# EasyEDA Pro project 一体板.epro, schematic Schematic1_1
Create Date: 2023-07-24; Page Name: P1; Project Name: 运放模块; Schematic Name: Schematic1; Update Date: 2023-07-25; Company: 嘉立创EDA; Page Size: A4; Version: V1.0
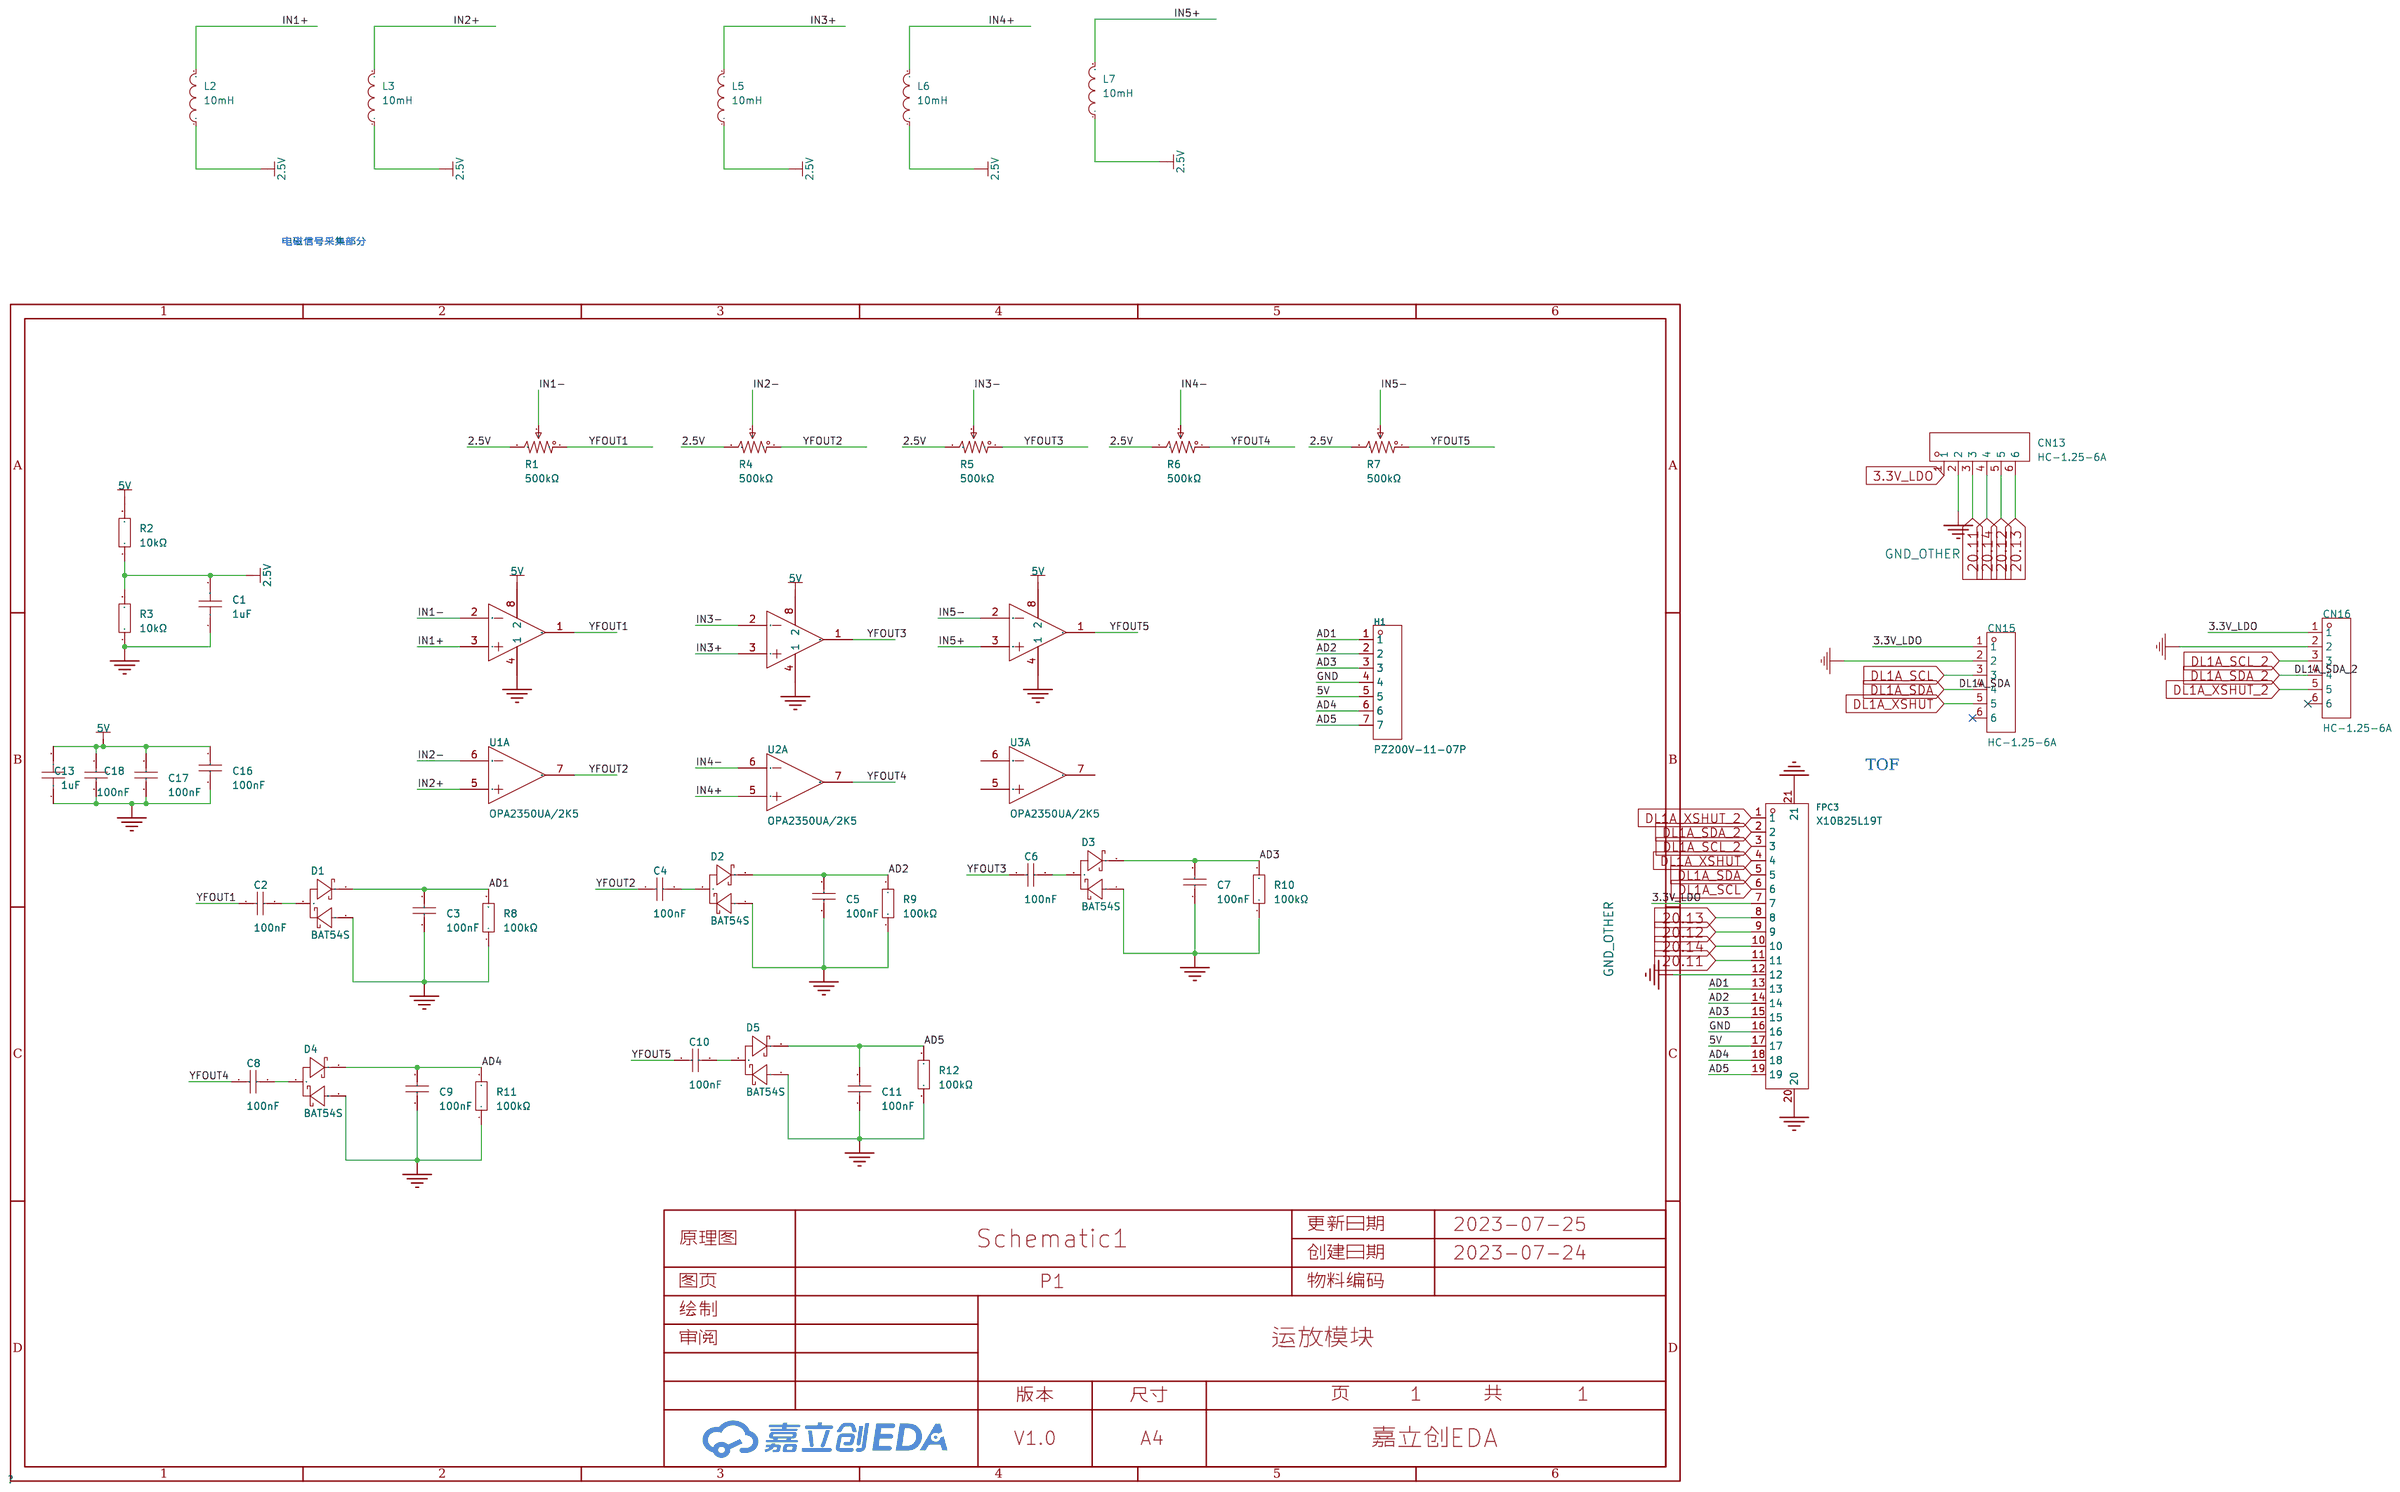
[diagram p1: schematic sheet]

## Parts
C1  1uF  [C0603]
C2  100nF  [C0603]
C3  100nF  [C0603]
C4  100nF  [C0603]
C5  100nF  [C0603]
C6  100nF  [C0603]
C7  100nF  [C0603]
C8  100nF  [C0603]
C9  100nF  [C0603]
C10  100nF  [C0603]
C11  100nF  [C0603]
C13  1uF  [C0603]
C16  100nF  [C0603]
C17  100nF  [C0603]
C18  100nF  [C0603]
CN13  HC-1.25-6A  [CONN-TH_6P-P1.25_HCTL_HC-1.25-6A]
CN15  HC-1.25-6A  [CONN-TH_6P-P1.25_HCTL_HC-1.25-6A]
CN16  HC-1.25-6A  [CONN-TH_6P-P1.25_HCTL_HC-1.25-6A]
D1  BAT54S  [SOT-23-3_L2.9-W1.3-P1.90-LS2.4-BR]
D2  BAT54S  [SOT-23-3_L2.9-W1.3-P1.90-LS2.4-BR]
D3  BAT54S  [SOT-23-3_L2.9-W1.3-P1.90-LS2.4-BR]
D4  BAT54S  [SOT-23-3_L2.9-W1.3-P1.90-LS2.4-BR]
D5  BAT54S  [SOT-23-3_L2.9-W1.3-P1.90-LS2.4-BR]
FPC3  X10B25L19T  [FPC-SMD_X10B25U19T]
H1  PZ200V-11-07P  [HDR-TH_7P-P2.00-V-M]
L2  10mH  [IND-TH_BD8.0-P3.00-D0.6]
L3  10mH  [IND-TH_BD8.0-P3.00-D0.6]
L5  10mH  [IND-TH_BD8.0-P3.00-D0.6]
L6  10mH  [IND-TH_BD8.0-P3.00-D0.6]
L7  10mH  [IND-TH_BD8.0-P3.00-D0.6]
R1  500kΩ  [RES-ADJ-TH_3P-L9.5-W4.85-P2.50-BL-BS]
R2  10kΩ  [R0603]
R3  10kΩ  [R0603]
R4  500kΩ  [RES-ADJ-TH_3P-L9.5-W4.85-P2.50-BL-BS]
R5  500kΩ  [RES-ADJ-TH_3P-L9.5-W4.85-P2.50-BL-BS]
R6  500kΩ  [RES-ADJ-TH_3P-L9.5-W4.85-P2.50-BL-BS]
R7  500kΩ  [RES-ADJ-TH_3P-L9.5-W4.85-P2.50-BL-BS]
R8  100kΩ  [R0603]
R9  100kΩ  [R0603]
R10  100kΩ  [R0603]
R11  100kΩ  [R0603]
R12  100kΩ  [R0603]
U1  OPA2350UA/2K5  [SOIC-8_L4.9-W3.9-P1.27-LS6.0-BL]  (section 1)
U2  OPA2350UA/2K5  [SOIC-8_L4.9-W3.9-P1.27-LS6.0-BL]  (section 1)
U3  OPA2350UA/2K5  [SOIC-8_L4.9-W3.9-P1.27-LS6.0-BL]  (section 1)

## Library data of the parts
C1 C13 = UMK107BJ105KA-T: 容值:1uF;精度:±10%;额定电压:50V;材质(温度系数):X5R;; LCSC Part Name: 1uF±10%50V; Supplier Part: C92848; Manufacturer: TAIYOYUDEN(太诱); Supplier Footprint: 0603; JLCPCB Part Class: 扩展库; Datasheet: https://atta.szlcsc.com/upload/public/pdf/source/20170103/1483439977668.pdf; Supplier: LCSC; Tolerance: ±10%; Voltage Rated: 50V; Temperature Coefficient: X5R
C2-C11 C16-C18 = 0603B104K500NT: 容值:100nF;精度:±10%;额定电压:50V;材质(温度系数):X7R;; LCSC Part Name: 100nF±10%50V; Supplier Part: C30926; Manufacturer: FH(风华); Supplier Footprint: 0603; JLCPCB Part Class: 扩展库; Datasheet: https://atta.szlcsc.com/upload/public/pdf/source/20170923/C30926_1506149436298988724.pdf; Supplier: LCSC; Tolerance: ±10%; Voltage Rated: 50V; Temperature Coefficient: X7R
CN13 CN15 CN16 = HC-1.25-6A: 参考系列:-;间距:1.25mm;插针结构:1x6P;排数:1;每排PIN数:6;行距:-;公母:公型插针;安装方式:直插;额定电流:1A;工作温度范围:-25℃~+85℃;; LCSC Part Name: 1.25mm1x6P直插; Supplier Part: C2845524; Manufacturer: HCTL(华灿天禄); Supplier Footprint: 插件,P=1.25mm; JLCPCB Part Class: ExtendedPart; Datasheet: https://atta.szlcsc.com/upload/public/pdf/source/20210729/C2845520_89EAA22C8D4DE2FB8A253230326912FB.pdf; Supplier: LCSC; Pitch: 1.25mm; Pins Structure: 1x6P; Number of Rows: 1; Number of PINs Per Row: 6; Gender: 公型插针; Mounting Style: 直插; Current Rating (Max): 1A; Operating Temperature Range: -25℃~+85℃
D1-D5 = BAT54S_C916425: 二极管配置:1对串联式;直流反向耐压(Vr):30V;平均整流电流(Io):200mA;正向压降(Vf):800mV@100mA;反向电流(Ir):2uA@25V;; LCSC Part Name: 30V 200mA 800mV@100mA; Supplier Part: C916425; Manufacturer: JSMSEMI(杰盛微); Supplier Footprint: SOT-23; JLCPCB Part Class: Extended Part; Datasheet: https://atta.szlcsc.com/upload/public/pdf/source/20211201/FE5B83CFA86769D78D832936AAE4C8C4.pdf; Supplier: LCSC; Diode Configuration: 1对串联式; Reverse Voltage (Vr): 30V; Average Rectified Current (Io): 200mA; Forward Voltage (Vf@If): 800mV@100mA; Reverse Leakage Current (Ir): 2uA@25V
FPC3 = X10B25L19T: 间距:1mm;触点数量:19;锁定特性:抽屉式;安装类型:卧贴;触点类型:下接;工作温度范围:-40℃~+85℃;焊接温度(最大值):260℃;; LCSC Part Name: 1mm P数:19 抽屉式 下接 镀锡; Supplier Part: C500178; Manufacturer: XKB Connectivity(中国星坤); Supplier Footprint: SMD,P=1mm; JLCPCB Part Class: Extended Part; Supplier: LCSC; Pitch: 1mm; Number of Contacts: 19; Locking Feature: 抽屉式; Mounting Type: 卧贴; Contact Type: 下接; Height Above Board: 2.5mm; FFC, FCB Thickness: 0.3mm; Contact Material: 磷青铜; Contact Plating: 锡; Operating Temperature Range: -40℃~+85℃; Welding Temperature (Max): 260℃
H1 = PZ200V-11-07P: 排数:单排;总PIN位数:7P;间距:2mm;插针结构:1x7P;行距:-;安装类型:直插;圆针/方针:方针;额定电流:-;额定电压:-;配合针长度:3.9mm;塑高:2mm;端接针长度:2.8mm;触头材质:黄铜;触头镀层:-;工作温度范围:-40℃~+105℃;焊接温度(最大值):-;颜色:黑色;; LCSC Part Name: 2mm 1x7P 直插 方针; Supplier Part: C541861; Manufacturer: XFCN(兴飞); Supplier Footprint: 插件,P=2mm; JLCPCB Part Class: Extended Part; Datasheet: https://atta.szlcsc.com/upload/public/pdf/source/20200518/C541858_7610F54454E936EFCDE06B655DF7C837.pdf; Supplier: LCSC; Number of Rows: 单排; Number of Pins: 7P; Pitch: 2mm; Pin Structure: 1x7P; Mounting Type: 直插; Circluar Pins/Square Pins: 方针; Length of Mating Pin: 3.9mm; Insulation Height: 2mm; Length of End Connection Pin: 2.8mm; Contact Material: 黄铜; Operating Temperature Range: -40℃~+105℃; Color: 黑色
L2 L3 L5-L7 = VLU0608-103K: 电感值:10mH;精度:±10%;额定电流:-;直流电阻(DCR):-;; LCSC Part Name: 10mH±10%; Supplier Part: C72613; Manufacturer: FH(风华); Supplier Footprint: 径向引线; JLCPCB Part Class: 扩展库; Datasheet: https://atta.szlcsc.com/upload/public/pdf/source/20160613/1465800080547.pdf; Supplier: LCSC; Tolerance: ±10%
R1 R4-R7 = 3296W-1-504: 阻值:500kΩ;精度:±10%;; LCSC Part Name: 500kΩ ±10%; Supplier Part: C118921; Manufacturer: BOCHEN(博晨); Supplier Footprint: 插件; JLCPCB Part Class: Extended Part; Datasheet: https://atta.szlcsc.com/upload/public/pdf/source/20171114/C118921_15106326579491117411.pdf; Supplier: LCSC; Tolerance: ±10%
R2 R3 = RC0603FR-0710KL: 电阻类型:厚膜电阻;阻值:10kΩ;精度:±1%;功率:100mW;; LCSC Part Name: 10kΩ ±1% 100mW; Supplier Part: C98220; Manufacturer: YAGEO(国巨); Supplier Footprint: 0603; JLCPCB Part Class: Extended Part; Datasheet: https://atta.szlcsc.com/upload/public/pdf/source/20170522/1495423494387.pdf; Supplier: LCSC; Type: 厚膜电阻; Tolerance: ±1%; Power(Watts): 100mW; Temperature Coefficient: ±100ppm/℃; Overload Voltage (Max): 75V; Operating Temperature Range: -55℃~+155℃
R8-R12 = 0603WAF1003T5E: 电阻类型:厚膜电阻;阻值:100kΩ;精度:±1%;功率:100mW;; LCSC Part Name: 100kΩ ±1% 100mW; Supplier Part: C25803; Manufacturer: UNI-ROYAL(厚声); Supplier Footprint: 0603; JLCPCB Part Class: Basic Part; Datasheet: https://atta.szlcsc.com/upload/public/pdf/source/20200306/C422600_1E6D84923E4A46A82E41ADD87F860B5C.pdf; Supplier: LCSC; Type: 厚膜电阻; Tolerance: ±1%; Power(Watts): 100mW; Temperature Coefficient: ±100ppm/℃; Overload Voltage (Max): 75V; Operating Temperature Range: -55℃~+155℃
U1-U3 = OPA2350UA/2K5: 放大器组数:2;; Supplier Part: C55904; Manufacturer: TI(德州仪器); Supplier Footprint: SOIC-8; JLCPCB Part Class: Extended Part; Datasheet: https://atta.szlcsc.com/upload/public/pdf/source/20150811/1457707345966.pdf; Supplier: LCSC; Number of Circuits: 2

## Nets
2.5V: C1.2 L2.1 L3.1 L5.1 L6.1 L7.1 R1.3 R2.1 R3.2 R4.3 R5.3 R6.3 R7.3
3.3V_LDO: CN13.1 CN15.1 CN16.1 FPC3.7
5V: C13.2 C16.2 C17.2 C18.2 FPC3.17 H1.5 R2.2 U1.8(2) U2.8(2) U3.8(2)
GND: C1.1 C3.1 C5.1 C7.1 C9.1 C11.1 C13.1 C16.1 C17.1 C18.1 D1.1(A) D2.1(A) D3.1(A) D4.1(A) D5.1(A) FPC3.16 FPC3.20 FPC3.21 H1.4 R3.1 R8.1 R9.1 R10.1 R11.1 R12.1 U1.4(1) U2.4(1) U3.4(1)
GND_OTHER: CN13.2 CN15.2 CN16.2 FPC3.12
20.11: CN13.3 FPC3.11
20.12: CN13.5 FPC3.9
20.13: CN13.6 FPC3.8
20.14: CN13.4 FPC3.10
AD1: C3.2 D1.2(K) FPC3.13 H1.1 R8.2
AD2: C5.2 D2.2(K) FPC3.14 H1.2 R9.2
AD3: C7.2 D3.2(K) FPC3.15 H1.3 R10.2
AD4: C9.2 D4.2(K) FPC3.18 H1.6 R11.2
AD5: C11.2 D5.2(K) FPC3.19 H1.7 R12.2
DL1A_SCL: CN15.3 FPC3.6
DL1A_SCL_2: CN16.3 FPC3.3
DL1A_SDA: CN15.4 FPC3.5
DL1A_SDA_2: CN16.4 FPC3.2
DL1A_XSHUT: CN15.5 FPC3.4
DL1A_XSHUT_2: CN16.5 FPC3.1
IN1+: L2.2 U1.3(IN B+)
IN1-: R1.2 U1.2(IN B-)
IN2+: L3.2 U1.5(IN B+)
IN2-: R4.2 U1.6(IN B-)
IN3+: L5.2 U2.3(IN B+)
IN3-: R5.2 U2.2(IN B-)
IN4+: L6.2 U2.5(IN B+)
IN4-: R6.2 U2.6(IN B-)
IN5+: L7.2 U3.3(IN B+)
IN5-: R7.2 U3.2(IN B-)
YFOUT1: C2.1 R1.1 U1.1(OUT B)
YFOUT2: C4.1 R4.1 U1.7(OUT B)
YFOUT3: C6.1 R5.1 U2.1(OUT B)
YFOUT4: C8.1 R6.1 U2.7(OUT B)
YFOUT5: C10.1 R7.1 U3.1(OUT B)
$1N1524: C2.2 D1.3
$1N1793: C4.2 D2.3
$1N1950: C6.2 D3.3
$1N2107: C8.2 D4.3
$1N2264: C10.2 D5.3

Not connected (* = marked no-connect by the designer): CN15 6*; CN16 6*; U3 5(IN B+) 6(IN B-) 7(OUT B)

## Notes on the sheet
- 电磁信号采集部分
- TOF
